# Altium schematic sheet Com.SchDoc
size A3; SheetNumber: 3; SheetTotal: 3
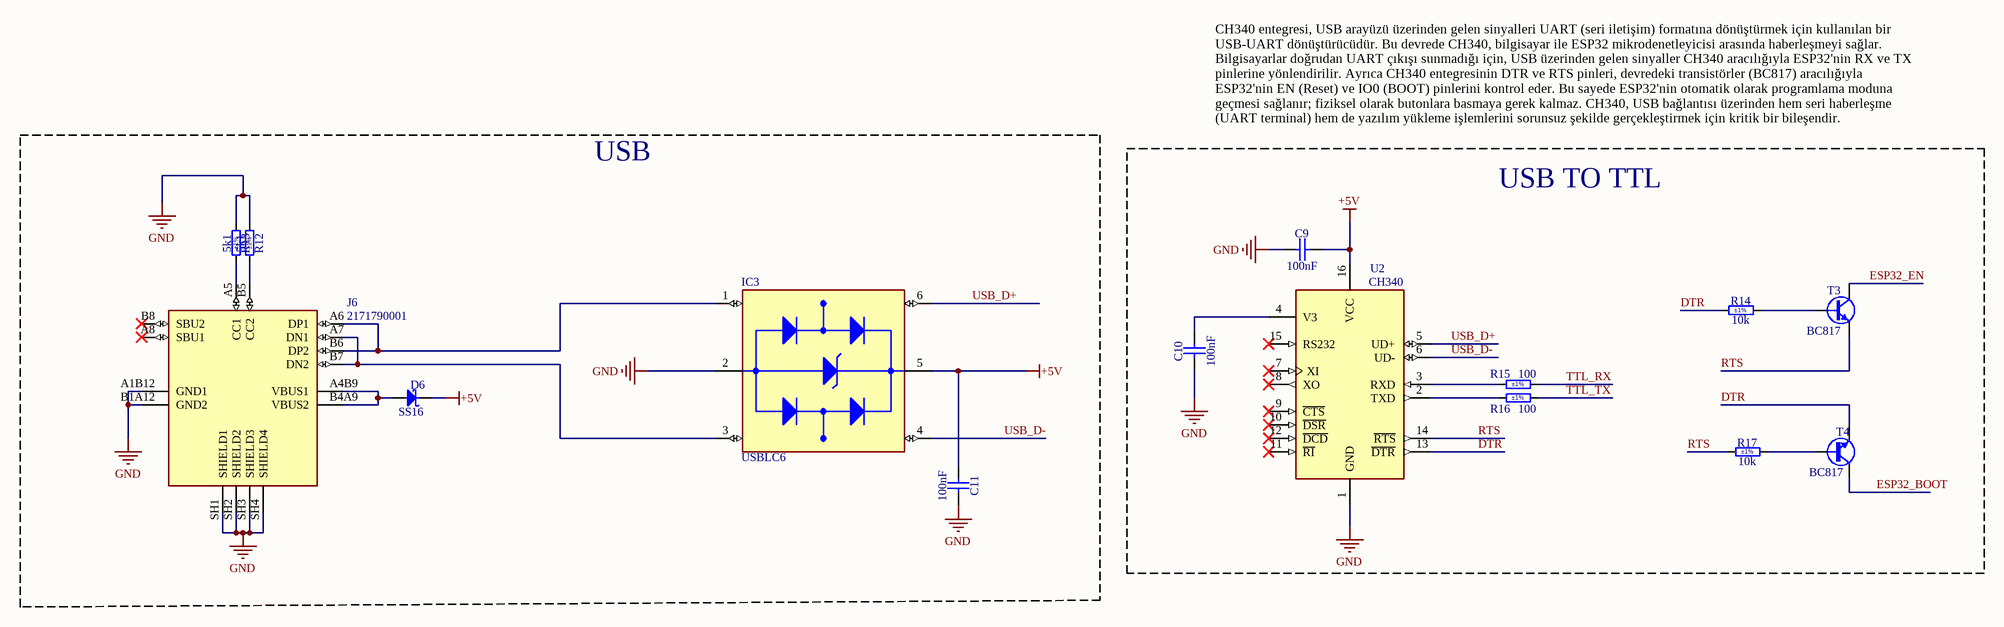
[diagram p0: Com.SchDoc]

## Parts
C9  100nF  [CAPC1608X87N]
C10  100nF  [CAPC1608X87N]
C11  100nF  [CAPC1608X87N]
D6  SS16  [DIOM5127X229N]
IC3  USBLC6  [USBC6]
J6  2171790001  [TYPEC]
R12  5k1  Tolerance: ±1%  [RESC1608X55N]
R13  5k1  Tolerance: ±1%  [RESC1608X55N]
R14  10k  Tolerance: ±1%  [RESC1608X55N]
R15  100  Tolerance: ±1%  [RESC1608X55N]
R16  100  Tolerance: ±1%  [RESC1608X55N]
R17  10k  Tolerance: ±1%  [RESC1608X55N]
T3  BC817  [SOT95P230X110-3N]
T4  BC817  [SOT95P230X110-3N]
U2  CH340  [CH340]

## Blocks framed on the sheet
USB: C11 D6 IC3 J6 R12 R13
USB TO TTL: C9 C10 R14-R17 T3 T4 U2

## Nets
+5V: C9.2 C11.2 D6.1(C) IC3.5(VBUS) U2.16(VCC)
GND: C9.1 C10.1 C11.1 IC3.2(GND) J6.A1B12(GND1) J6.B1A12(GND2) J6.SH1(SHIELD1) J6.SH2(SHIELD2) J6.SH3(SHIELD3) J6.SH4(SHIELD4) R12.2 R13.2 U2.1(GND)
DTR: R14.1 T4.2(E) U2.13(~{DTR})
ESP32_BOOT: T4.3(C)
ESP32_EN: T3.3(C)
RTS: R17.1 T3.2(E) U2.14(~{RTS})
TTL_RX: R15.2
TTL_TX: R16.2
USB_D+: IC3.6(I/O1_OUT) U2.5(UD+)
USB_D-: IC3.4(I/O2_OUT) U2.6(UD-)
NetC10_2: C10.2 U2.4(V3)
NetD6_2: D6.2(A) J6.A4B9(VBUS1) J6.B4A9(VBUS2)
NetIC3_1: IC3.1(I/O1_IN) J6.A6(DP1) J6.B6(DP2)
NetIC3_3: IC3.3(I/O2_IN) J6.A7(DN1) J6.B7(DN2)
NetJ6_A5: J6.A5(CC1) R13.1
NetJ6_B5: J6.B5(CC2) R12.1
NetR14_2: R14.2 T3.1(B)
NetR15_1: R15.1 U2.3(RXD)
NetR16_1: R16.1 U2.2(TXD)
NetR17_2: R17.2 T4.1(B)

Not connected (* = marked no-connect by the designer): J6 A8(SBU1)* B8(SBU2)*; U2 7(XI)* 8(XO)* 9(~{CTS})* 10(~{DSR})* 11(~{RI})* 12(~{DCD})* 15(RS232)*

## Notes on the sheet
- CH340 entegresi, USB arayüzü üzerinden gelen sinyalleri UART (seri iletişim) formatına dönüştürmek için kullanılan bir USB-UART dönüştürücüdür. Bu devrede CH340, bilgisayar ile ESP32 mikrodenetleyicisi arasında haberleşmeyi sağlar. Bilgisayarlar doğrudan UART çıkışı sunmadığı için, USB üzerinden gelen sinyaller CH340 aracılığıyla ESP32'nin RX ve TX pinlerine yönlendirilir. Ayrıca CH340 entegresinin DTR ve RTS pinleri, devredeki transistörler (BC817) aracılığıyla ESP32'nin EN (Reset) ve IO0 (BOOT) pinlerini kontrol eder. Bu sayede ESP32'nin otomatik olarak programlama moduna geçmesi sağlanır; fiziksel olarak butonlara basmaya gerek kalmaz. CH340, USB bağlantısı üzerinden hem seri haberleşme (UART terminal) hem de yazılım yükleme işlemlerini sorunsuz şekilde gerçekleştirmek için kritik bir bileşendir.

## Library data of the parts
C9-C11 = CC0603_100NF_50V_10%_X5R: Non-polarised capacitor; Part Description: SMD Multilayer Chip Ceramic Capacitor; Manufacturer: GENERIC; Manufacturer1 Part Number: C1608X5R1H104K080; Voltage: 50V; TC: X5R; Tolerance: ±10%; Part Number: CC0603_100NF_50V_10%_X5R; Component Kind: Standard; Component Type: Standard; Pin Count: 2; Value: 100nF; Status: None; Manufacturer Part Number: CC0603_100NF_50V_10%_X5R; Case: 0603; Mounted: Yes; Socket: No; SMD: Yes; Sense: No; Manufacturer1 Example: TDK; Manufacturer1 ComponentHeight: 0.9mm; HelpURL: \\cern.ch\dfs\Applications\Altium\Datasheets\CC0603_X5R_TDK_C.pdf; Author: CERN DEM MR; CreateDate: 8.01.2016; LatestRevisionDate: 8.01.2016
D6 = SS16: Schottky Diode; Part Description: Surface Mount Schottky Barrier Rectifier; Manufacturer: VISHAY GENERAL SEMICONDUCTOR; Voltage: 60V; Power: 1A; PressFit: No; Bonding: No; Part Number: SS16; Component Kind: Standard; Component Type: Standard; Device: SS16; PackageDescription: DO-214-AC/SMA Diode, Molded Body; 5.10mm L X 2.67mm W X 2.29mm H, IPC Medium Density; Manufacturer Part Number: SS16; Pin Count: 2; Case: DO-214AC; Mounted: Yes; Socket: No; SMD: Yes; Sense: No; ComponentHeight: 2.29mm; HelpURL: \\cern.ch\dfs\Applications\Altium\Datasheets\SS16.pdf; Author: CERN DEM JLC; CreateDate: 15.07.2008; LatestRevisionDate: 23.08.2010
J6 = TypeC USB2.0 16pin SMD
R12 R13 = R0603_5K1_1%_0.1W_100PPM: Resistor - 1%; Part Description: General Purpose Thick Film Chip Resistor; Manufacturer: GENERIC; Manufacturer1 Part Number: NRC06F5101TRF; Power: 0.1W; TC: ±100ppm/°C; PressFit: No; Part Number: R0603_5K1_1%_0.1W_100PPM; Component Kind: Standard; Component Type: Standard; Pin Count: 2; Value: 5k1; Status: Preferred; Manufacturer Part Number: R0603_5K1_1%_0.1W_100PPM; Case: 0603; Mounted: Yes; Sense: No; Socket: No; SMD: Yes; Manufacturer1 Example: NIC COMPONENT; Manufacturer1 ComponentHeight: 0.55mm; HelpURL: \\cern.ch\dfs\Applications\Altium\Datasheets\R0603_NIC_NRC.pdf; Author: CERN DEM JLC; CreateDate: 3.12.2007; LatestRevisionDate: 13.03.2008
R14 R17 = R0603_10K_1%_0.1W_100PPM: Resistor - 1%; Part Description: General Purpose Thick Film Chip Resistor; Manufacturer: GENERIC; Manufacturer1 Part Number: NRC06F1002TRF; Power: 0.1W; TC: ±100ppm/°C; PressFit: No; Part Number: R0603_10K_1%_0.1W_100PPM; Component Kind: Standard; Component Type: Standard; Pin Count: 2; Value: 10k; Status: Preferred; Manufacturer Part Number: R0603_10K_1%_0.1W_100PPM; Case: 0603; Mounted: Yes; Sense: No; Socket: No; SMD: Yes; Manufacturer1 Example: NIC COMPONENT; Manufacturer1 ComponentHeight: 0.55mm; HelpURL: \\cern.ch\dfs\Applications\Altium\Datasheets\R0603_NIC_NRC.pdf; Author: CERN DEM JLC; CreateDate: 3.12.2007; LatestRevisionDate: 13.03.2008
R15 R16 = R0603_100R_1%_0.1W_100PPM: Resistor - 1%; Part Description: General Purpose Thick Film Chip Resistor; Manufacturer: GENERIC; Manufacturer1 Part Number: NRC06F4700TRF; Power: 0.1W; TC: ±100ppm/°C; PressFit: No; Part Number: R0603_100R_1%_0.1W_100PPM; Component Kind: Standard; Component Type: Standard; Pin Count: 2; Value: 100; Status: Preferred; Manufacturer Part Number: R0603_100R_1%_0.1W_100PPM; Case: 0603; Mounted: Yes; Sense: No; Socket: No; SMD: Yes; Manufacturer1 Example: NIC COMPONENT; Manufacturer1 ComponentHeight: 0.55mm; HelpURL: \\cern.ch\dfs\Applications\Altium\Datasheets\R0603_NIC_NRC.pdf; Author: CERN DEM JLC; CreateDate: 3.12.2007; LatestRevisionDate: 13.03.2008
T3 T4 = BC817: NPN Transistor; Part Description: 45V 500mA NPN General-Purpose Transistor; Manufacturer: NXP SEMICONDUCTORS; PressFit: No; Bonding: No; Part Number: BC817; Component Kind: Standard; Component Type: Standard; Device: BC817; PackageDescription: SOT23, 0.95mm Pitch; 3 Pin, 1.30mm W X 2.90mm L X 1.10mm H body, IPC Medium Density; Manufacturer Part Number: BC817; Pin Count: 3; Case: SOT23-3; Mounted: Yes; Socket: No; SMD: Yes; Sense: No; ComponentHeight: 1.1mm; HelpURL: \\cern.ch\dfs\Applications\Altium\Datasheets\BC817.pdf; Author: CERN DEM JLC; CreateDate: 12.05.2011; LatestRevisionDate: 12.05.2011